# EAGLE design Contact_V1.0 (EAGLE 9.4.1)
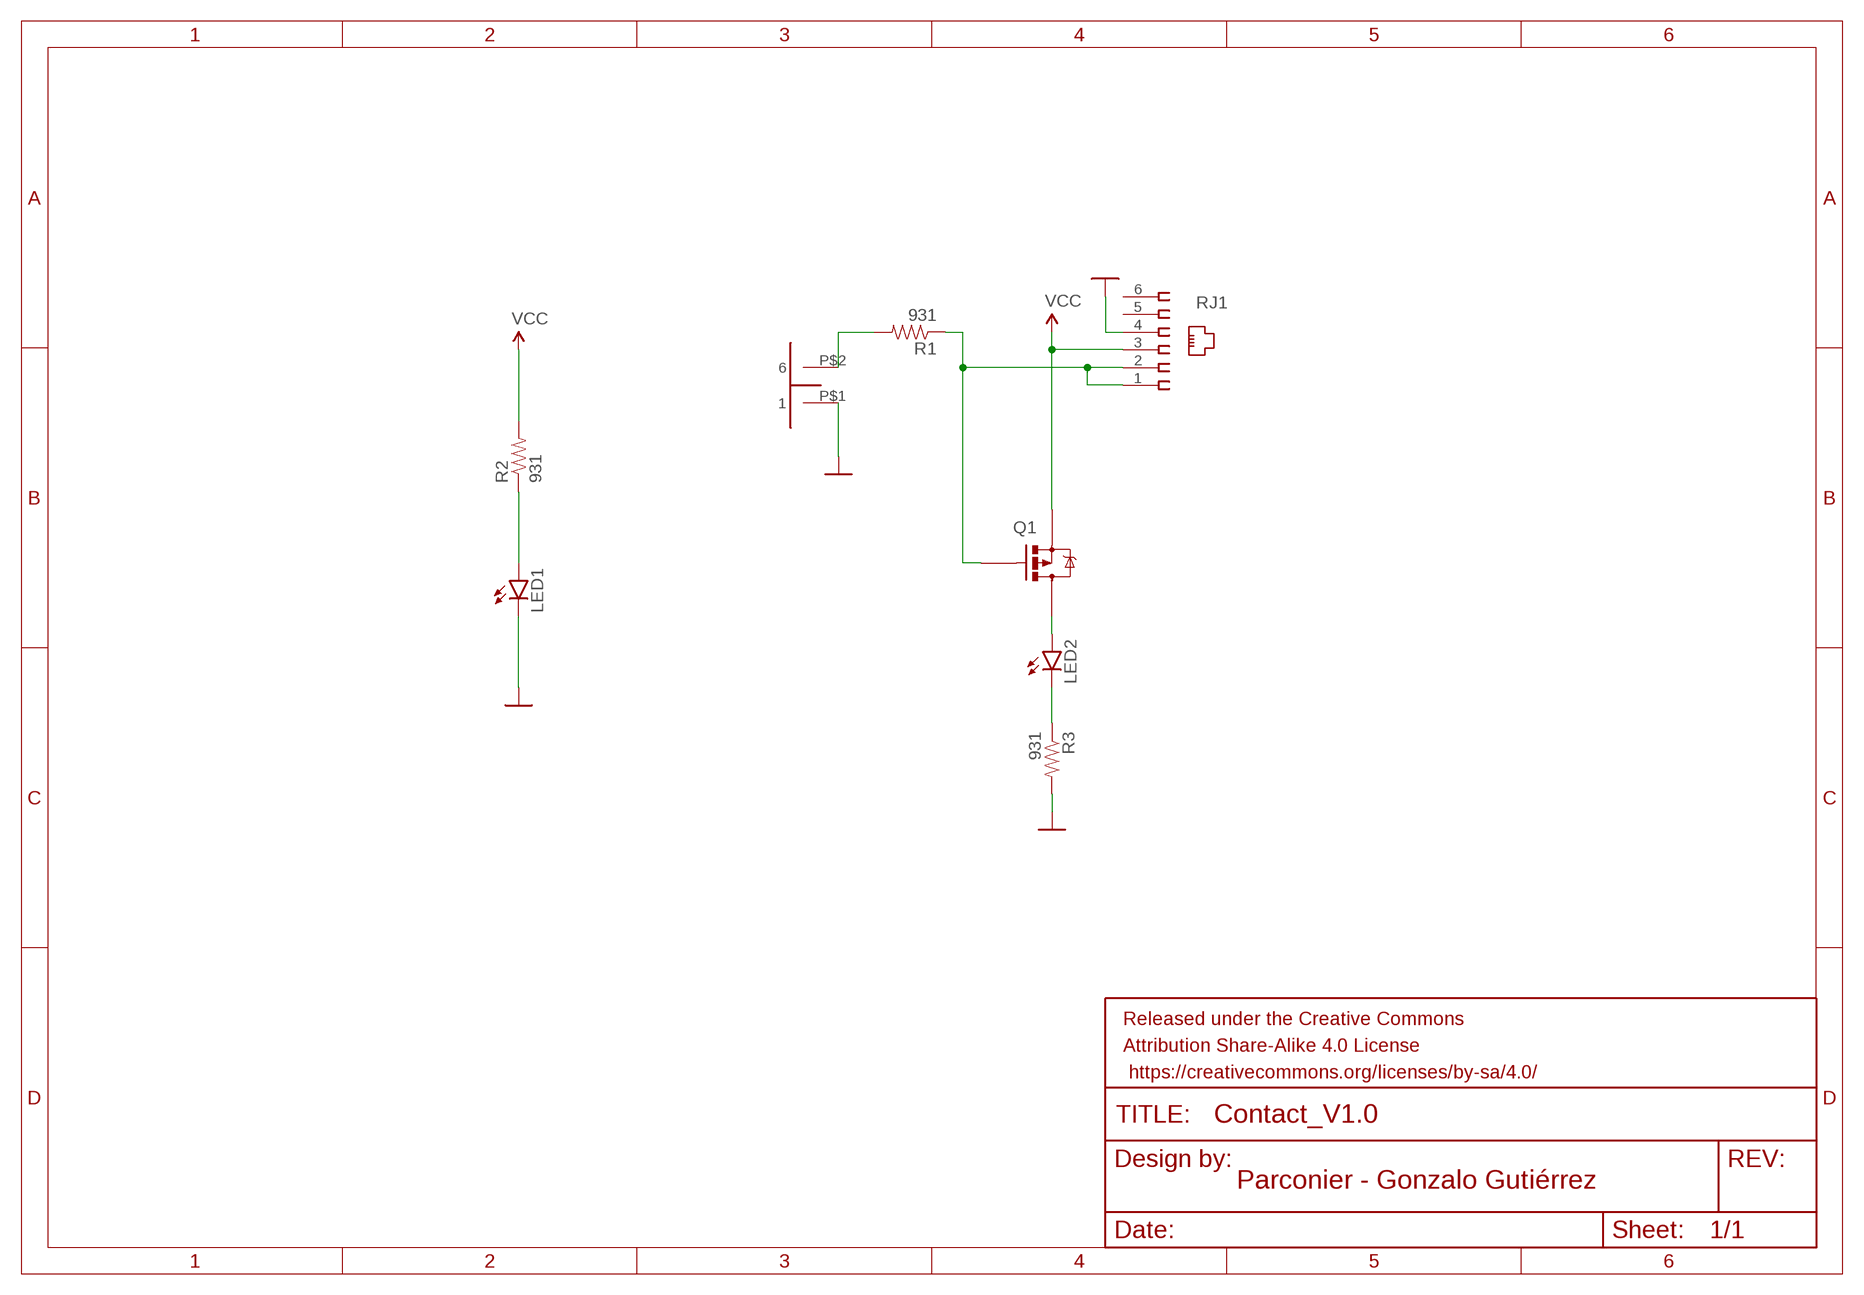
[diagram p0: schematic, sheet 1]

## Parts
LED1  LED0603  [LED-0603]
LED2  LED0603  [LED-0603]
PB1  PUSHBUTTON_MOKO  [SUBSTITUTE_FSM104_RIGHT_ANGLE]
Q1  RU1C002ZPTCL  [SOTFL65P210X105-3N]
R1  931  RES_0402  [RESC1005X35]
R2  931  RES_0402  [RESC1005X35]
R3  931  RES_0402  [RESC1005X35]
RJ1  615006138421  [615006138421]

## Nets
GND: LED1.C PB1.P$1 R3.2 RJ1.4
N$1: PB1.P$2 R1.2
N$2: Q1.1(G) R1.1 RJ1.1 RJ1.2
N$3: LED2.A Q1.3(D)
N$4: LED2.C R3.1
N$30: LED1.A R2.1
VCC: Q1.2(S) R2.2 RJ1.3
Unconnected: RJ1.5 RJ1.6

## Library data of the parts
LED1 = SparkFun-LED:LED: LEDs Standard schematic elements and footprints for 5mm, 3mm, 1206, and 0603 sized LEDs. 5mm - Spark Fun Electronics SKU : COM-00529 (and others); MPN: LTST-C193KRKT-5A
LED2 = SparkFun-LED:LED: LEDs Standard schematic elements and footprints for 5mm, 3mm, 1206, and 0603 sized LEDs. 5mm - Spark Fun Electronics SKU : COM-00529 (and others); MPN: LB Q39E-L2OO-35-1
PB1 = Button:PUSHBUTTON_MOKO; MOKO: 12E-01
Q1 = RU1C002ZPTCL:RU1C002ZPTCL: ROHM - RU1C002ZPTCL - MOSFET, P-CH, -20V, -0.2A, SOT-323FL Source: Datasheet <https://componentsearchengine.com/Datasheets/2/RU1C002ZPTCL.pdf>; ARROW_PART_NUMBER: RU1C002ZPTCL; DESCRIPTION: ROHM - RU1C002ZPTCL - MOSFET, P-CH, -20V, -0.2A, SOT-323FL; HEIGHT: 1.05mm; MANUFACTURER_NAME: ROHM Semiconductor; MANUFACTURER_PART_NUMBER: RU1C002ZPTCL; MPN: RU1C002ZPTCL
R1-R3 = Perfect_0402:RES_0402; MPN: RC0402FR-07931RL
RJ1 = 615006138421:615006138421: HORIZONTAL PLASTIC 6P6C MODULAR JACK TAP UP Source: Datasheet <http://docs-europe.electrocomponents.com/webdocs/0f88/0900766b80f88670.pdf>; DESCRIPTION: HORIZONTAL PLASTIC 6P6C MODULAR JACK TAP UP; HEIGHT: mm; MANUFACTURER_NAME: W&uuml;rth Elektronik; MANUFACTURER_PART_NUMBER: 615006138421; MPN: 615006138421; RS_PART_NUMBER: 7350282; SUPPLIER_NAME: RS

## Net classes
0 Default: width 0.203 mm

## Board
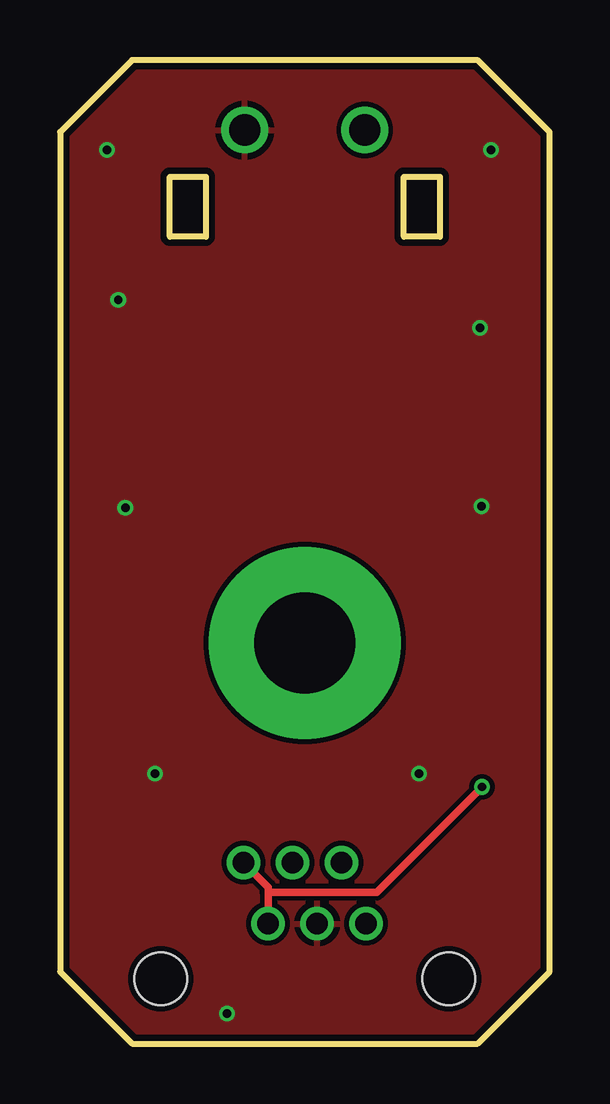
[diagram p1: board, top side]
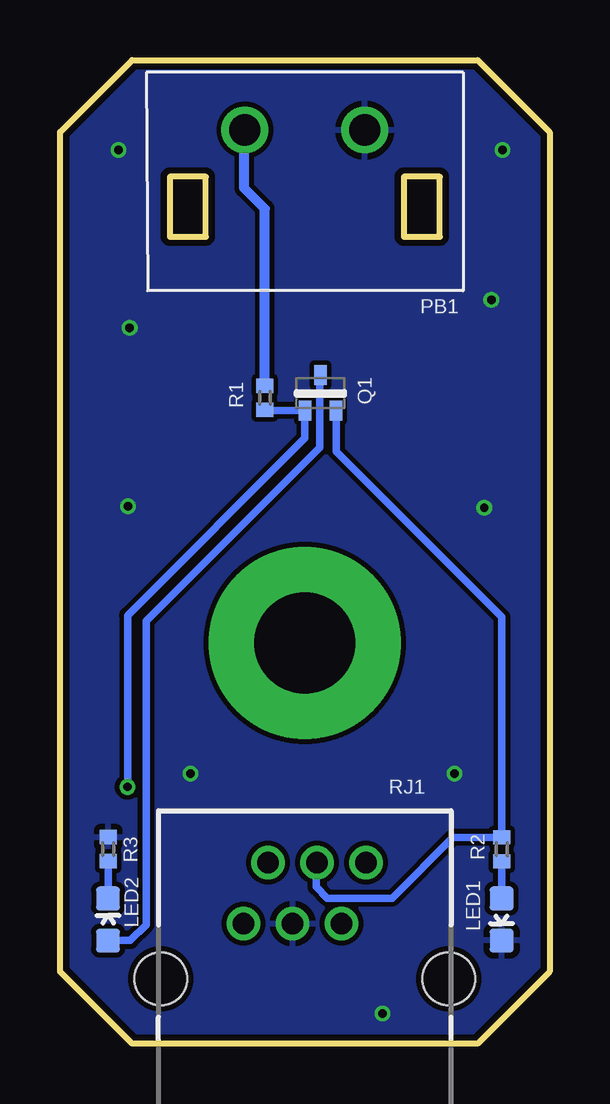
[diagram p2: board, bottom side, seen from below]

Size 20.4 x 41 mm. Coordinates in mm from the lower left corner, seen from the top.
Outline: 0,38 0,3 3,0 17.4,0 20.4,3 20.4,38 17.4,41 3,41 0,38
Outline: 14.32,33.63 14.32,36.13 15.82,36.13 15.82,33.63 14.32,33.63
Outline: 6.08,33.63 4.58,33.63 4.58,36.13 6.08,36.13 6.08,33.63
Copper layers (1*16): Top 0.035mm / dielectric 1.5mm / Bottom 0.035mm
Design rules "SeeedStudio_2layer_DRU_no_angle_20140221": minimum track width 6mil, minimum drill 12mil, track to track 6mil, track to pad 6mil, pad to pad 6mil, via to via 6mil, smd to smd 0mil, copper to edge 10mil, drill to drill 10mil, minimum pad ring 10mil, minimum via ring 6mil, stop-mask expansion 2mil, vias tented up to drill 100mil, thermal gap 10mil

### Footprints (pad centres in the part's own frame; a part is rotated, then mirrored left to right if it is on the bottom)
LED-0603 = smd 1 x 1: A 0,-0.877; C 0,0.877
SUBSTITUTE_FSM104_RIGHT_ANGLE = drill 1.3: P$1 -2.5,0; P$2 2.5,0
SOTFL65P210X105-3N = smd 0.83 x 0.52: 1 -0.735,0.65; 2 -0.735,-0.65; 3 0.735,0
RESC1005X35 = smd 0.6 x 0.7: 1 -0.5,0; 2 0.5,0
615006138421 = drill 0.9 pad 1.4: 1 2.55,4.84; 2 1.53,2.3; 3 0.51,4.84; 4 -0.51,2.3; 5 -1.53,4.84; 6 -2.55,2.3 | hole 2.2: -6,0; 6,0

### Placement (x,y rotation side)
LED1  2,5.17 180 bottom
LED2  18.4,5.17 0 bottom
PB1  10.2,38.08 180 bottom
Q1  9.55,27.12 90 bottom
R1  11.87,26.91 90 bottom
R2  2,8.09 90 bottom
R3  18.39,8.1 90 bottom
RJ1  10.2,2.7 0 bottom

### Tracks (layer width: path | path; a pad name or v marks a point on that pad's centre or on a via)
GND  (via drill 0.35)
  other vias: 17.96,37.25 1.96,37.25 2.43,31 2.72,22.34 3.96,11.25 14.96,11.25 6.96,1.25 17.57,22.39 17.5,29.84
  pour Top (isolate 0.2): 20.4,41 0,41 0,0 20.4,0
  pour Bottom (isolate 0.2): 20.4,0 0,0 0,41 20.4,41
N$1
  Bottom 0.406: R1.2 11.87,34.8 12.73,35.66 12.73,38.05 PB1.P$2
N$2  (via drill 0.35)
  Top 0.305: v17.58,10.7 13.2,6.31 8.68,6.31 8.67,6.3 | RJ1.1 8.67,6.52 8.67,6.3 | 8.67,6.3 RJ1.2
  Bottom 0.305: R1.1 11.84,26.39 Q1.1 10.2,25.24 17.58,17.85 v17.58,10.7
N$3
  Bottom 0.305: LED2.A 17.46,4.29 16.81,4.95 16.81,17.61 9.57,24.84 9.57,27.83 Q1.3
N$4
  Bottom 0.305: LED2.C 18.4,7.59 R3.1
N$5  (via drill 4.2 pad 8)
  other vias: 10.2,16.7
N$30
  Bottom 0.305: R2.1 | LED1.A R2.1
VCC
  Bottom 0.305: RJ1.3 9.73,7.5 9.73,6.52 9.26,6.05 6.57,6.05 4.03,8.59 R2.2 2,17.77 1.99,17.77 8.9,24.68 Q1.2